# EAGLE design panelolu 2.1 (EAGLE 6.2)
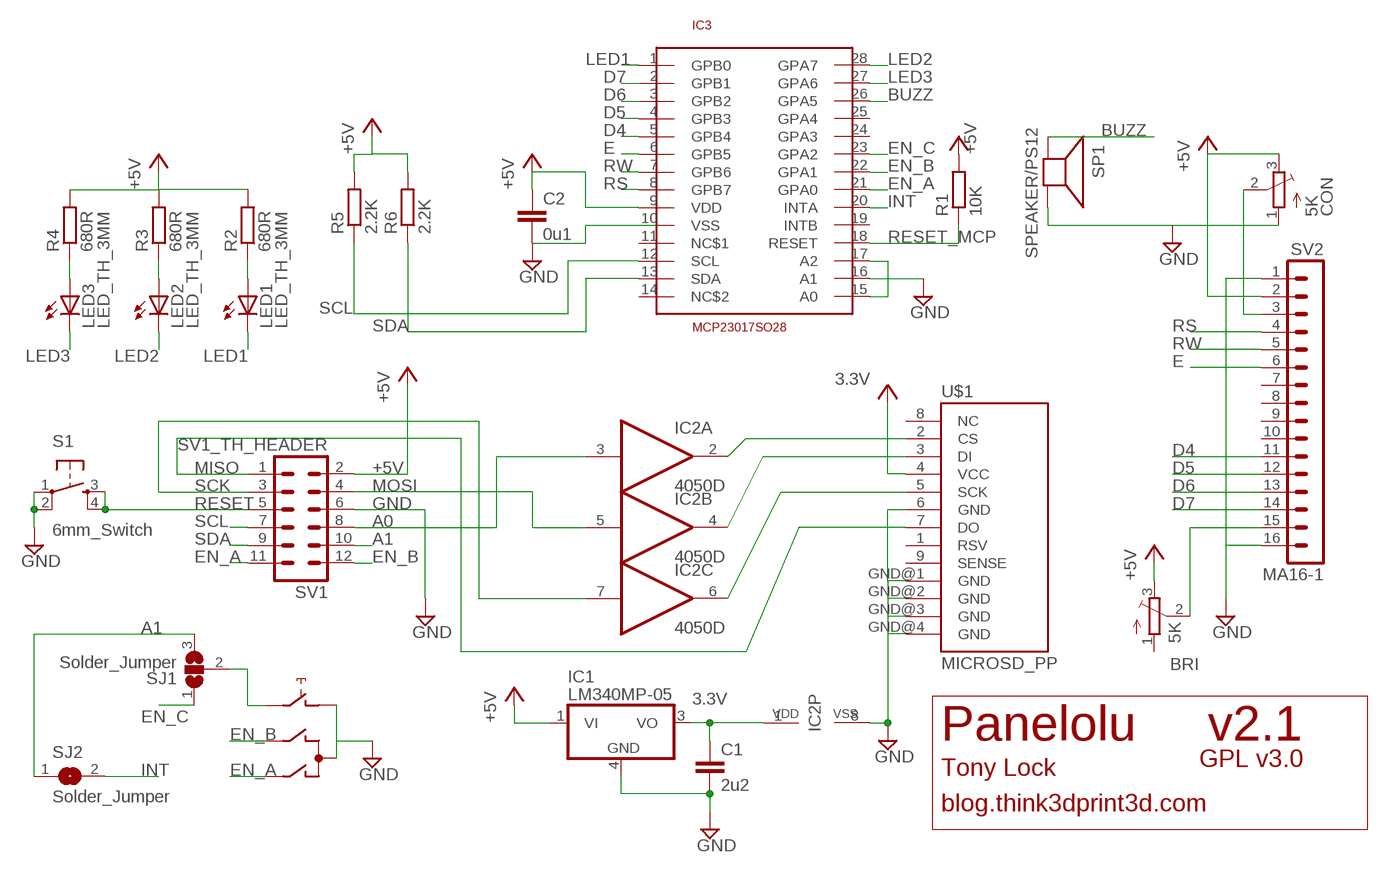
[diagram p0: schematic, sheet 1]

## Parts
BRI  5K  TRIMPOTTC33X  [TC33X]
C1  2u2  C-EUC1206K  [C1206K]
C2  0u1  C-EUC0805K  [C0805K]
CON  5K  TRIMPOTTC33X  [TC33X]
IC1  LM340MP-05  [SOT223]
IC2  4050D  [SO16]
IC3  MCP23017SO28  [SO28W]
LED1  LED_TH_3MM  LED3MM  [LED3MM]
LED2  LED_TH_3MM  LED3MM  [LED3MM]
LED3  LED_TH_3MM  LED3MM  [LED3MM]
R1  10K  R-EU_M0805  [M0805]
R2  680R  R-EU_M0805  [M0805]
R3  680R  R-EU_M0805  [M0805]
R4  680R  R-EU_M0805  [M0805]
R5  2.2K  R-EU_M0805  [M0805]
R6  2.2K  R-EU_M0805  [M0805]
S1  6mm_Switch  TAC_SWITCHPTH  [TACTILE-PTH]
SJ1  Solder_Jumper  SJ2W  [SJ_2]
SJ2  Solder_Jumper  SJ  [SJ]
SP1  SPEAKER/PS12  [PS12]
SV1  SV1_TH_HEADER  MA06-2  [MA06-2]
SV2  MA16-1  [MA16-1]
SW1  EC12E_SW  [ALPS_EC12E_SW]
U$1  MICROSD_PP  [MICROSD_PP]

## Nets
3.3V: C1.1 IC1.3(VO) IC2.1(P:VDD) U$1.4(VCC)
+5V [power]: BRI.3(E) C2.1 CON.3(E) IC1.1(VI) IC3.9(VDD) R1.2 R2.2 R3.2 R4.2 R5.2 R6.2 SV1.2 SV2.2
A0: IC2.3(A:I) SV1.8
A1: SJ1.3 SJ2.1 SV1.10
BUZZ: IC3.26(GPA5) SP1.P$1(+)
CS3.3: IC2.2(A:O) U$1.2(CS)
D4: IC3.5(GPB4) SV2.11
D5: IC3.4(GPB3) SV2.12
D6: IC3.3(GPB2) SV2.13
D7: IC3.2(GPB1) SV2.14
DI3.3: IC2.4(B:O) U$1.3(DI)
E: IC3.6(GPB5) SV2.6
EN_A: IC3.21(GPA0) SV1.11 SW1.A
EN_B: IC3.22(GPA1) SV1.12 SW1.B
EN_C: IC3.23(GPA2) SJ1.1
GND: C1.2 C2.2 CON.1(A) IC1.4(GND) IC2.8(P:VSS) IC3.10(VSS) IC3.15(A0) IC3.16(A1) IC3.17(A2) S1.1 S1.2 SP1.P$2(-) SV1.6 SV2.1 SV2.16 SW1.C SW1.D U$1.6(GND) U$1.GND@1(GND) U$1.GND@2(GND) U$1.GND@3(GND) U$1.GND@4(GND)
INT: IC3.20(INTA) SJ2.2
LED1: IC3.1(GPB0) LED1.K(C)
LED2: IC3.28(GPA7) LED2.K(C)
LED3: IC3.27(GPA6) LED3.K(C)
MISO: SV1.1 U$1.7(DO)
MOSI: IC2.5(B:I) SV1.4
N$2: BRI.2(S) SV2.15
N$3: CON.2(S) SV2.3
N$5: LED1.A R2.1
N$6: LED2.A R3.1
N$7: LED3.A R4.1
N$9: SJ1.2 SW1.E
RESET: S1.3 S1.4 SV1.5
RESET_MCP: IC3.18(RESET) R1.1
RS: IC3.8(GPB7) SV2.4
RW: IC3.7(GPB6) SV2.5
SCK: IC2.7(C:I) SV1.3
SCK3.3: IC2.6(C:O) U$1.5(SCK)
SCL: IC3.12(SCL) R5.1 SV1.7
SDA: IC3.13(SDA) R6.1 SV1.9
Unconnected: BRI.1(A) IC2.9(D:I) IC2.10(D:O) IC2.11(E:I) IC2.12(E:O) IC2.14(F:I) IC2.15(F:O) IC3.11(NC$1) IC3.14(NC$2) IC3.19(INTB) IC3.24(GPA3) IC3.25(GPA4) SV2.7 SV2.8 SV2.9 SV2.10 SW1.GND1(G) SW1.GND2(G) U$1.1(RSV) U$1.8(NC) U$1.9(SENSE)

## Notes on the sheet
- Panelolu | v2.1
- GPL v3.0
- Tony Lock
- blog.think3dprint3d.com

## Library data of the parts
BRI CON = adafruit:TRIMPOT: SMT trimmer potentiometer part number TC33X http://www.ladyada.net/library/eagle
C1 = rcl:C-EU: CAPACITOR, European symbol
C2 = resistor:C-EU: CAPACITOR, European symbol
IC1 = linear:LM340?-*: Positive VOLTAGE REGULATOR Source: http://cache.national.com/ds/LM/LM340.pdf
IC2 = 40xx:4050: Hex non-inverting BUFFER
IC3 = tony:MCP23017
LED1-LED3 = sanguinololu:LED: LEDs Standard schematic elements and footprints for 5mm, 3mm, 1206, and 0603 sized LEDs. 5mm - Spark Fun Electronics SKU : COM-00529 (and others)
R1-R6 = resistor:R-EU_: RESISTOR, European symbol
S1 = sanguinololu:TAC_SWITCH: Momentary Switch Button commonly used for reset or general input. Spark Fun Electronics SKU : COM-00097
SJ1 = jumper:SJ2W: SMD solder JUMPER
SJ2 = jumper:SJ: SMD solder JUMPER
SP1 = adafruit:SPEAKER: SPEAKER Source: Buerklin Added PS12 (for part # PS1240 piezo) http://www.ladyada.net/library/pcb/eaglelibrary.html
SV1 = con-lstb:MA06-2: PIN HEADER; OC_FARNELL: unknown; OC_NEWARK: unknown
SV2 = con-lstb:MA16-1
SW1 = switch-alps:EC12E_SW: ALPS rotary Encoder EC12E series with switch; MPN: EC12E2424407; OC_FARNELL: 1520813; OC_NEWARK: 74M1068
U$1 = DE1594-v2:MICROSD_PP

## Board
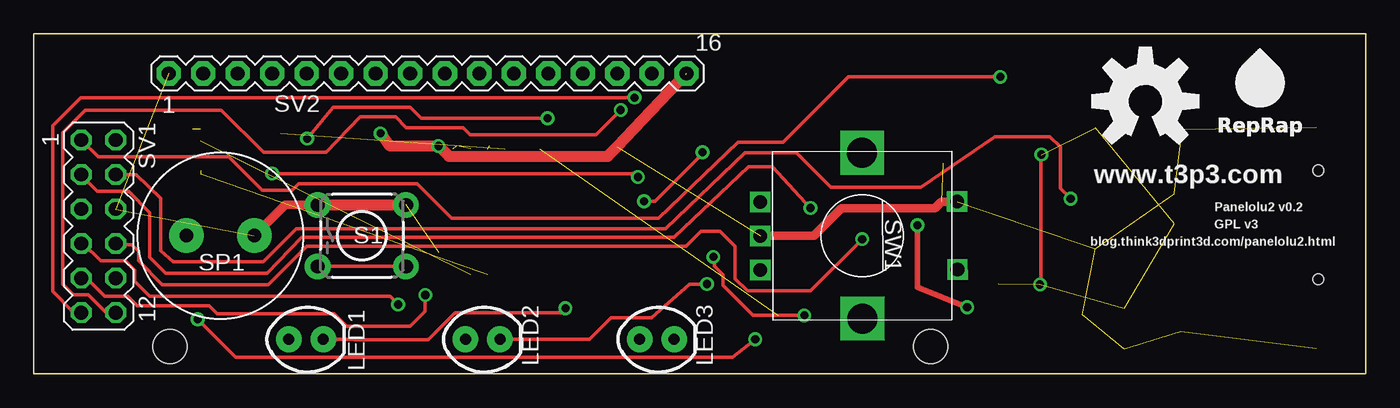
[diagram p1: board, top side]
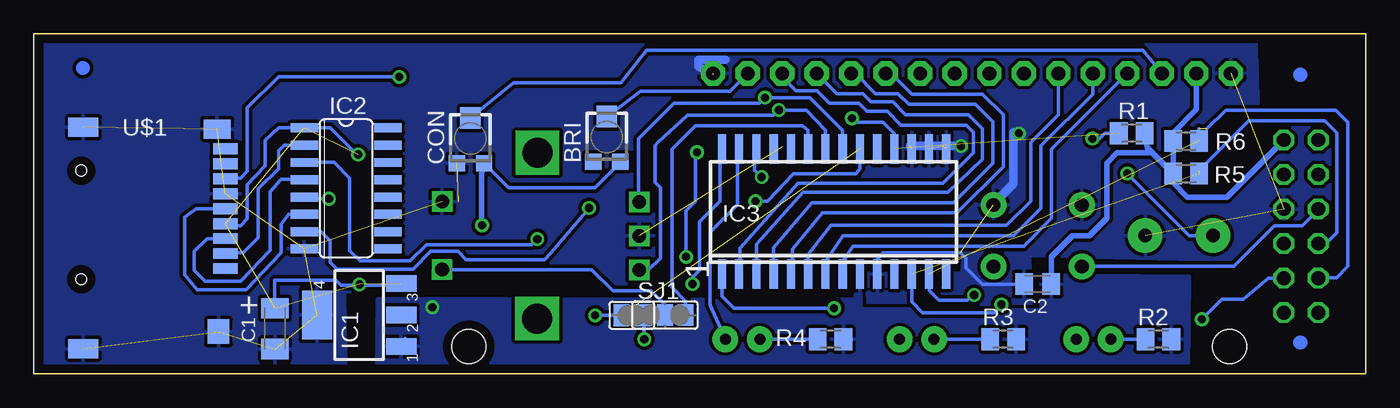
[diagram p2: board, bottom side, seen from below]

Size 98 x 25 mm. Coordinates in mm from the lower left corner, seen from the top.
Outline: 0,0 0,25 98,25 98,0 0,0
Copper layers (1*16): Top 0.035mm / dielectric 1.5mm / Bottom 0.035mm
Design rules: minimum track width 10mil, minimum drill 24mil, track to track 8mil, track to pad 8mil, pad to pad 8mil, via to via 9mil, smd to smd 8mil, copper to edge 25mil, drill to drill 12mil, minimum pad ring 10mil, minimum via ring 8mil, stop-mask expansion 4mil, vias tented up to drill 0mil, thermal gap 10mil
Holes 2.5 mm at 10,2 66,2

### Footprints (pad centres in the part's own frame; a part is rotated, then mirrored left to right if it is on the bottom)
TC33X = smd 1.2 x 1.2: 1 -1,-1.825; 3 1,-1.825 | smd 1.5 x 1.6: 2 0,1.5
C1206K = smd 1.5 x 2: 1 -1.5,0; 2 1.5,0
C0805K = smd 1.3 x 1.6: 1 -1,0; 2 1,0
SOT223 = smd 1.219 x 2.235: 1 -2.311,-3.099; 2 0,-3.099; 3 2.311,-3.099 | smd 3.6 x 2.2: 4 0,3.099
SO16 = smd 0.66 x 2.032: 1 -4.445,-3.073; 2 -3.175,-3.073; 3 -1.905,-3.073; 4 -0.635,-3.073; 5 0.635,-3.073; 6 1.905,-3.073; 7 3.175,-3.073; 8 4.445,-3.073; 9 4.445,3.073; 10 3.175,3.073; 11 1.905,3.073; 12 0.635,3.073; 13 -0.635,3.073; 14 -1.905,3.073; 15 -3.175,3.073; 16 -4.445,3.073
SO28W = smd 0.6 x 2.2: 1 -8.255,-4.6; 2 -6.985,-4.6; 3 -5.715,-4.6; 4 -4.445,-4.6; 5 -3.175,-4.6; 6 -1.905,-4.6; 7 -0.635,-4.6; 8 0.635,-4.6; 9 1.905,-4.6; 10 3.175,-4.6; 11 4.445,-4.6; 12 5.715,-4.6; 13 6.985,-4.6; 14 8.255,-4.6; 15 8.255,4.6; 16 6.985,4.6; 17 5.715,4.6; 18 4.445,4.6; 19 3.175,4.6; 20 1.905,4.6; 21 0.635,4.6; 22 -0.635,4.6; 23 -1.905,4.6; 24 -3.175,4.6; 25 -4.445,4.6; 26 -5.715,4.6; 27 -6.985,4.6; 28 -8.255,4.6
LED3MM = drill 0.813 pad 1.88: A -1.27,0; K 1.27,0
M0805 = smd 1.3 x 1.6: 1 -0.95,0; 2 0.95,0
TACTILE-PTH = drill 1.016 pad 1.88: 1 -3.251,2.261; 2 3.251,2.261; 3 -3.251,-2.261; 4 3.251,-2.261
SJ_2 = smd 1.168 x 1.6: 1 -1.524,0; 2 0,0; 3 1.524,0
SJ = smd 1.168 x 1.6: 1 -0.762,0; 2 0.762,0
PS12 = drill 1 pad 2.54: P$1 -2.5,0; P$2 2.5,0
MA06-2 = drill 1.016 octagon: 1 -6.35,-1.27; 2 -6.35,1.27; 3 -3.81,-1.27; 4 -3.81,1.27; 5 -1.27,-1.27; 6 -1.27,1.27; 7 1.27,-1.27; 8 1.27,1.27; 9 3.81,-1.27; 10 3.81,1.27; 11 6.35,-1.27; 12 6.35,1.27
MA16-1 = drill 1.016 pad 1.778 octagon: 1 -8.89,0; 2 -6.35,0; 3 -3.81,0; 4 -1.27,0; 5 1.27,0; 6 3.81,0; 7 6.35,0; 8 8.89,0; 9 11.43,0; 10 13.97,0; 11 16.51,0; 12 19.05,0; 13 21.59,0; 14 24.13,0; 15 26.67,0; 16 29.21,0
ALPS_EC12E_SW = drill 1 square: A -2.5,-7.5; B 2.5,-7.5; C 0,-7.5; D -2.5,7; E 2.5,7 | drill 2.2 square: GND1 -6.1,0; GND2 6.1,0
MICROSD_PP = smd 1.8 x 0.8: 1 0,3.85; 2 0,2.75; 3 0,1.65; 4 0,0.55; 5 0,-0.55; 6 0,-1.65; 7 0,-2.75; 8 0,-3.85; 9 0,-4.95 | smd 1.6 x 1.8: GND@1 0.5,8.5 | smd 2.2 x 1.4: GND@2 10.45,9.75; GND@4 10.45,-6.55 | smd 2 x 1.4: GND@3 0.6,-6.4 | hole 0.8: 10.6,4.65; 10.6,-3.35

### Placement (x,y rotation side)
BRI  55.84,17.42 0 bottom
C1  80.26,3.32 270 bottom
C2  24.13,6.6 180 bottom
CON  65.88,17.32 0 bottom
IC1  74.07,4.33 90 bottom
IC2  75.03,13.64 270 bottom
IC3  39.12,11.94 0 bottom
LED1  20.02,2.54 0 top
LED2  33.02,2.54 0 top
LED3  45.85,2.54 0 top
R1  17.2,17.7 0 bottom
R2  15.24,2.54 0 bottom
R3  26.67,2.54 0 bottom
R4  39.37,2.54 0 bottom
R5  13.21,14.73 180 bottom
R6  13.21,17.13 180 bottom
S1  24.13,10.16 0 top
SJ1  51.56,4.32 180 bottom
SJ2  54,4.3 180 bottom
SP1  13.72,10.16 0 top
SV1  4.75,10.85 270 top
SV2  18.8,22.1 0 top
SW1  60.96,10.16 270.1 top
U$1  83.92,11.6 180 bottom

### Tracks (layer width: path | path; a pad name or v marks a point on that pad's centre or on a via)
3.3V  (via drill 0.6)  (5 unrouted)
  Bottom 0.254: IC2.1 78.08,18.06
  other vias: 74.04,6.57 74.14,16.13
+5V  (via drill 0.6)
  Top 0.406: v68.68,4.9 65.02,6.35 v65.02,10.92
  Bottom 0.254: 70.9,2.4 70.7,2.6 | 14.2,17.7 14.2,17.18 R6.2 | BRI.3 54.84,15.56 56.7,13.7 63.09,13.7 CON.3
  Bottom 0.406: R5.2 R6.2 | 38.42,2.73 R4.2 38.35,2.54 | IC3.9 37.34,7.21 | 23.11,6.6 C2.1 23.13,8.62 21.59,10.16 20.32,10.16 19.05,11.43 19.05,15.49 18.29,16.26 15.68,16.26 | v65.02,10.92 65.04,10.94 65.04,14.73 CON.3 | SV1.2 10.22,13 13.1,13 14.16,14.06 R5.2 | R5.2 15.68,16.26 | SV2.2 12.45,19.45 14.2,17.7 | R1.2 16.05,16.62 15.68,16.26
  pour Bottom (isolate 0.254): 23.88,7.27 12.95,7.17 13.05,0.1 72.8,0.1 72.7,5.51 63.25,5.51 63.25,5.5 37.59,5.5 37.29,7.74 37.13,7.74 37.13,4.83 23.88,4.73
A0  (via drill 0.6)
  Top 0.254: v60.96,9.91 57.15,6.1 52.5,6.1 51.6,7 51.6,9.4 50.5,10.5 49.1,10.5 48,9.4 20.07,9.4 17.22,6.55 9.45,6.55 7.7,8.3 7.7,9 7.2,9.5 6.1,9.5 SV1.8
  Bottom 0.254: IC2.3 75.92,15.54 74.78,14.4 74.78,9.07 74.77,9.07 74,8.3 70.3,8.3 69.1,9.5 61.37,9.5 v60.96,9.91
A1  (via drill 0.6)
  Top 0.254: v53.09,2.54 51.41,1.22 17.8,1.2 14.86,1.2 v12.05,4.02
  Bottom 0.254: 6.02,7 SV1.10 7.16,7.04 9,5.5 10.56,5.5 v12.05,4.02 | v53.09,2.54 SJ1.3 53.22,4.32 SJ2.1
BUZZ  (via drill 0.6)
  Top 0.254: v44.45,14.48 44.2,14.73 v17.53,14.73
  Bottom 0.254: IC3.26 44.96,16.41 44.96,14.99 v44.45,14.48 | v17.53,14.73 12.95,10.16 SP1.P$1
CS3.3
  Bottom 0.254: IC2.2 79.58,16.82 80,16.4 80,15.1 81.5,13.6 81.5,10 82.6,8.9 83.87,8.9 U$1.2
D4
  Bottom 0.254: IC3.5 42.16,7.46 42.16,9.14 39.97,11.84 30.07,11.84 26.67,15.24 26.67,19.05 28.19,20.57 33.39,20.57 34.91,22.1 SV2.11
D5
  Bottom 0.254: IC3.4 43.56,9.27 40.73,12.6 30.33,12.6 27.43,15.49 27.43,18.54 28.7,19.81 33.61,19.81 34.4,20.6 36.06,20.6 37.55,22.1 SV2.12
D6
  Bottom 0.254: IC3.3 44.83,9.53 41.39,13.36 30.73,13.36 28.19,15.8 28.19,18.03 29.21,19.05 33.85,19.05 34.8,20 36.4,20 37,20.6 38.9,20.6 SV2.13
D7
  Bottom 0.254: IC3.2 46.03,7.46 46.03,9.25 41.76,14.02 31.09,14.02 28.86,16.26 28.86,17.78 29.36,18.29 34.19,18.29 35.2,19.3 36.7,19.3 37.3,19.9 39.46,19.9 40.39,20.83 41.91,20.83 42.93,21.85 SV2.14
DI3.3
  Bottom 0.254: IC2.4 78.13,14.3 79.8,14.3 80.6,13.4 80.6,9.1 82.8,6.8 85.4,6.8 86.2,7.6 86.2,9 85.25,9.95 U$1.3
E
  Bottom 0.254: SV2.6 22.61,19.04 24.64,17.02 24.64,12.7 26.42,10.92 39.36,10.92 41.02,8.76 IC3.6
EN_A  (via drill 0.6)
  Top 0.254: SV1.11 3.44,4.54 2.89,4.54 1.37,6.06 1.37,18.26 3.43,20.32 v44.2,20.32
  Bottom 0.254: 38.48,17.65 IC3.21 38.48,17.91 40.89,20.32 v44.2,20.32 44.6,19.92 50.88,19.92 53.5,17.3 53.5,12.69 SW1.A
EN_B  (via drill 0.6)
  Top 0.254: SV1.12 5.3,4.5 4,5.8 2.9,5.8 2.13,6.57 2.13,17.75 3.79,19.4 13.8,19.4 16.9,16.3 21.5,16.3 24,18.9 26.6,18.9 27.4,18.1 31.6,18.1 32.1,17.6 41.38,17.6 v43.18,19.4
  Bottom 0.254: 39.75,17.65 IC3.22 39.75,17.91 41.15,19.4 v43.18,19.4 43.58,19 49.88,19 52.07,17.02 52.3,16.79 52.3,14.1 51.9,13.7 51.9,8.5 52.75,7.65 SW1.B
EN_C
  Bottom 0.254: IC3.23 41.02,17.91 41.46,18.24 49.32,18.24 51.05,16.51 51.05,6.35 50.04,5.33 SJ1.1
GND  (via drill 0.6)  (17 unrouted)
  Top 0.61: S1.1 18.48,12.42 SP1.P$2 | SW1.D 66.77,12.67 66.29,12.19 59.44,12.19 57.4,10.16 53.47,10.16 SW1.C
  Top 0.813: v25.5,17.69 26.15,16.79 v29.77,16.76 30.54,16 42.22,16 42.93,16.71 48,22.08 SV2.16 | S1.1 S1.2
  Bottom 0.254: IC3.10 35.94,8.46 35.5,8.9 29.8,8.9 29.4,8.5 29.4,7.8 28.2,6.6 C2.2
  Bottom 0.61: 33.53,16.76 31.09,16.76 v29.77,16.76 | v25.5,17.69 25.91,17.78 25.91,13.97 27.38,12.5 S1.2 | 47.1,23.1 49.1,23.1 49.1,22.6 48,22 47.9,22.1
  pour Bottom (isolate 0.254, rank 6): 7.9,19.19 -1.1,19.3 -1,-1.2 12.19,-1.1 12.19,8.37 24.74,8.67 24.64,5.03 27.6,5.03 27.8,5.1 36.62,5.03 36.7,7.4 29.7,7.4 29.6,9.09 36.52,9.09 47.72,9.29 47.72,5.84 75.13,6.04 75.03,-1.2 99.44,-1.1 99.44,26.29 66.9,26.29 8.1,26.1
INT  (1 unrouted)
LED1  (via drill 0.6)
  Top 0.254: LED1.K 23.54,2.54 23.6,2.5 29,2.5 31,4.5 38.79,4.5 v39.12,4.83
  Bottom 0.254: v39.12,4.83 46.48,4.83 47.37,5.71 IC3.1
LED2  (via drill 0.6)
  Top 0.254: v49.53,6.6 48.26,6.6 45.47,4.11 42.46,4.11 40.89,2.54 LED2.K
  Bottom 0.254: IC3.28 47.5,16.11 47.5,12.7 49.02,11.18 49.02,7.62 49.53,7.11 v49.53,6.6
LED3
  Bottom 0.254: IC3.27 46.23,16.41 46.23,12.45 48.26,10.41 48.26,5.08 LED3.K
MISO  (via drill 0.6)
  Top 0.254: SV1.1 4.71,15.97 14.33,15.97 16.8,13.5 19,13.5 19.47,13.97 28.19,13.97 30.73,11.43 45.97,11.43 51.82,17.02 55.12,17.02 59.94,21.84 v71.12,21.84
  Bottom 0.254: v71.12,21.84 80.01,21.84 82.3,19.56 82.3,14.9 82.8,14.4 83.87,14.4 U$1.7
MOSI  (via drill 0.6)
  Top 0.254: v76.3,12.88 75.54,13.64 75.54,16.69 74.78,17.45 70.71,17.45 65.28,13.72 58.67,13.72 56.13,16.26 52.32,16.26 46.48,10.67 19.3,10.67 16.86,8.23 10.26,8.23 9.34,9.04 9.34,12.92 7.51,14.66 SV1.4
  Bottom 0.254: IC2.5 77.98,12.88 v76.3,12.88
N$1
  pour Bottom (isolate 0.61): 94.4,23 arc90 93.9,22.5 arc90 94.4,22 arc90 94.9,22.5 arc90
N$2
  Bottom 0.254: SV2.15 46.77,20.8 53.36,20.8 BRI.2
N$3
  Bottom 0.254: CON.2 62.7,21.4 54.8,21.4 52.9,23.8 16.4,23.8 SV2.3
N$4
  Bottom 0.254: 74.1,6.5 71,6.5 71,6.3
N$5
  Bottom 0.254: R2.1 LED1.A
N$6
  Bottom 0.254: R3.1 LED2.A
N$7
  Bottom 0.254: R4.1 LED3.A
N$8
  Bottom 0.254: 77.7,18.1 76.2,18.1 74.2,16.1
N$9
  Bottom 0.254: SW1.E 56.95,7.67 55.37,6.1 52.58,6.1 51.56,5.08 SJ1.2
N$10
  Top 0.254: 74.1,6.5 74.1,16.1
N$11
  Bottom 0.254: 74.2,6.5 75.4,6.5 75.8,6.9 80.3,6.9 80.3,5.4 80.2,5.2 80.1,5.2 80.1,5.1
N$12
  Bottom 0.254: 78.9,18.1 80,18.1 81,17.2 81,15.3 82.3,13.9 82.3,11.4 82.8,10.9 83.8,10.9 83.9,11
N$13
  Bottom 0.254: 33.4,7 33.4,5.3 32.6,4.5 27.3,4.5 26.8,5
N$14  (via drill 0.6)
  other vias: 28.8,5.8
N$15
  Bottom 0.254: 28.9,5.8 29.3,5.4 31.4,5.4 32.1,6.1 32.1,6.8
N$16  (via drill 0.6)
  Top 0.254: 3.6,9.6 4.9,8.3 6.7,8.3 7.4,7.6 7.4,6.8 8.5,5.7 26.2,5.7 v26.8,5.1
N$17
  Top 0.254: 28.8,5.7 28.8,4.6 27.7,3.5 23,3.5 22.1,4.4 13.5,4.4 12.9,5 7.6,5 6.9,5.7 5.2,5.7 3.8,7.1 3.5,7.1
N$18
  Bottom 0.254: 37.2,15.8 37.2,15.1 37.5,14.7 42.1,14.7 44,12.7
N$19  (via drill 0.6)
  Bottom 0.254: v44.9,12.7 44.1,12.7
N$20  (via drill 0.6)
  other vias: 49.2,16.3
N$21
  Top 0.254: 45,12.7 45.7,12.7 49.2,16.2
N$22
  Top 0.254: 50.1,8.6 50.1,7.9 50.7,7.3 50.7,6.5 52.9,4.3 56.6,4.3
N$23  (via drill 0.6)
  Bottom 0.254: 49.3,16.2 49.3,12.7 50,12 v50,8.6
N$24  (via drill 0.6)
  Bottom 0.254: 55,4.3 v56.7,4.3
N$26  (via drill 0.6)
  Top 0.254: v37.8,18.8 28.5,18.8 27.7,19.6 22,19.6 v20.1,17.3
  Bottom 0.254: 34.7,16.9 34.7,17.7 35.5,18.5 37.5,18.5 v37.8,18.8
N$27
  Bottom 0.254: 19.6,17.3 19.2,17.7 18.1,17.7
RESET
  Top 0.254: S1.3 S1.4
  Bottom 0.254: SV1.5 3.48,12.08 4.67,10.89 6.71,10.89 9.7,7.9 S1.3
RESET_MCP  (1 unrouted)
RS
  Bottom 0.254: IC3.8 38.48,8.26 37.74,9.4 25.15,9.4 23.11,11.43 23.11,16.52 SV2.4
RW
  Bottom 0.254: IC3.7 39.75,8.26 38.45,10.16 25.91,10.16 23.88,12.19 23.88,16.76 20.07,20.57 SV2.5
SCK  (via drill 0.6)
  Top 0.254: v57.15,12.19 54.36,15.24 52.58,15.24 47.12,10.03 19.68,10.03 17.15,7.4 9.7,7.4 8.53,8.57 8.53,11.86 6.96,13.43 4.67,13.43 3.48,14.62 SV1.3
  Bottom 0.254: v57.15,12.19 59.94,8.89 60.43,8.4 66.2,8.4 66.8,9 68.8,9 70.1,7.7 75.7,7.7 76.2,8.2 76.2,9.8 76.86,10.46 IC2.7
SCK3.3
  Bottom 0.254: IC2.6 79.27,11.73 79.8,11 79.8,8.9 82.4,6.2 86,6.2 86.9,7.3 86.9,11.5 86.05,12.15 U$1.5
SCL  (2 unrouted)
  Bottom 0.254: SV1.7 3.44,9.62 2.89,9.62 2.13,10.38 2.13,17.75 2.98,18.6 8.6,18.6 12.26,14.94
SDA  (2 unrouted)
  Bottom 0.254: SV1.9 3.44,7.08 2.13,7.08 1.3,7.91 1.3,18.5 2.2,19.4 10.3,19.4 11.67,18.03 | R6.1 12.26,18.04
(copper drawn outside any net)
  shapes: Bottom circle x3

### Text on the board
bPlace: 1 | +
_tsilk: www.t3p3.com | Panelolu2 v0.2 | GPL v3 | blog.think3dprint3d.com/panelolu2.html